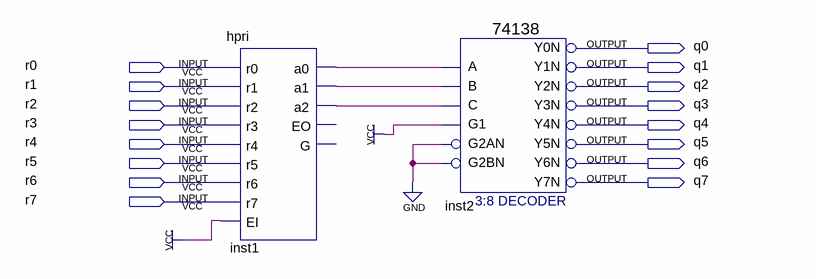
[diagram p0: schematic sheet]
// Quartus schematic pointer.bdf as structural Verilog: 2 symbols, 16 pins
module pointer (
  input  r0,
  input  r1,
  input  r2,
  input  r3,
  input  r4,
  input  r5,
  input  r6,
  input  r7,
  output q0,
  output q1,
  output q2,
  output q3,
  output q4,
  output q5,
  output q6,
  output q7
);

  wire inst1_a0, inst1_a1, inst1_a2;

  hpri inst1 (
    .r0(r0), .r1(r1), .r2(r2), .r3(r3), .r4(r4), .r5(r5), .r6(r6), .r7(r7), .EI(1'b1), .a0(inst1_a0),
    .a1(inst1_a1), .a2(inst1_a2));  // open: EO, G
  \74138  inst2 (
    .A(inst1_a0), .B(inst1_a1), .G1(1'b1), .C(inst1_a2), .G2AN(1'b0), .G2BN(1'b0), .Y0N(q0), .Y1N(q1),
    .Y2N(q2), .Y3N(q3), .Y4N(q4), .Y5N(q5), .Y6N(q6), .Y7N(q7));
endmodule
